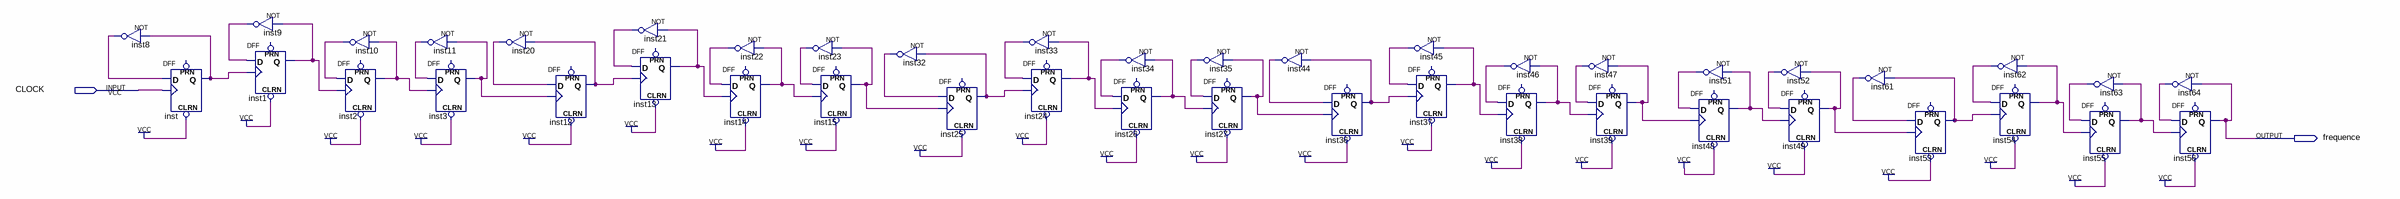
[diagram p0: schematic sheet]
// Quartus schematic basculeDbuzzer.bdf as structural Verilog: 44 symbols, 2 pins
module basculeDbuzzer (
  input  CLOCK,
  output frequence
);

  wire inst1_q, inst2_q, inst3_q, inst8_out, inst9_out, inst10_out, inst11_out, inst12_q, inst13_q, inst14_q,
       inst15_q, inst20_out, inst21_out, inst22_out, inst23_out, inst24_q, inst25_q, inst26_q, inst27_q,
       inst32_out, inst33_out, inst34_out, inst35_out, inst36_q, inst37_q, inst38_q, inst39_q, inst44_out,
       inst45_out, inst46_out, inst47_out, inst48_q, inst49_q, inst51_out, inst52_out, inst53_q, inst54_q,
       inst55_q, inst61_out, inst62_out, inst63_out, inst64_out, inst_q;

  not inst8 (inst8_out, inst_q);
  DFF inst (.CLRN(1'b1), .CLK(CLOCK), .D(inst8_out), .Q(inst_q));  // open: PRN
  not inst9 (inst9_out, inst1_q);
  DFF inst1 (.CLRN(1'b1), .CLK(inst_q), .D(inst9_out), .Q(inst1_q));  // open: PRN
  not inst10 (inst10_out, inst2_q);
  DFF inst2 (.CLRN(1'b1), .CLK(inst1_q), .D(inst10_out), .Q(inst2_q));  // open: PRN
  not inst11 (inst11_out, inst3_q);
  DFF inst3 (.CLRN(1'b1), .CLK(inst2_q), .D(inst11_out), .Q(inst3_q));  // open: PRN
  not inst20 (inst20_out, inst12_q);
  DFF inst12 (.CLRN(1'b1), .CLK(inst3_q), .D(inst20_out), .Q(inst12_q));  // open: PRN
  not inst21 (inst21_out, inst13_q);
  DFF inst13 (.CLRN(1'b1), .CLK(inst12_q), .D(inst21_out), .Q(inst13_q));  // open: PRN
  not inst22 (inst22_out, inst14_q);
  DFF inst14 (.CLRN(1'b1), .CLK(inst13_q), .D(inst22_out), .Q(inst14_q));  // open: PRN
  not inst23 (inst23_out, inst15_q);
  DFF inst15 (.CLRN(1'b1), .CLK(inst14_q), .D(inst23_out), .Q(inst15_q));  // open: PRN
  not inst32 (inst32_out, inst25_q);
  DFF inst25 (.CLRN(1'b1), .CLK(inst15_q), .D(inst32_out), .Q(inst25_q));  // open: PRN
  not inst33 (inst33_out, inst24_q);
  DFF inst24 (.CLRN(1'b1), .CLK(inst25_q), .D(inst33_out), .Q(inst24_q));  // open: PRN
  DFF inst26 (.CLRN(1'b1), .CLK(inst24_q), .D(inst34_out), .Q(inst26_q));  // open: PRN
  not inst34 (inst34_out, inst26_q);
  not inst35 (inst35_out, inst27_q);
  DFF inst27 (.CLRN(1'b1), .CLK(inst26_q), .D(inst35_out), .Q(inst27_q));  // open: PRN
  not inst44 (inst44_out, inst36_q);
  DFF inst36 (.CLRN(1'b1), .CLK(inst27_q), .D(inst44_out), .Q(inst36_q));  // open: PRN
  not inst45 (inst45_out, inst37_q);
  DFF inst37 (.CLRN(1'b1), .CLK(inst36_q), .D(inst45_out), .Q(inst37_q));  // open: PRN
  DFF inst38 (.CLRN(1'b1), .CLK(inst37_q), .D(inst46_out), .Q(inst38_q));  // open: PRN
  not inst46 (inst46_out, inst38_q);
  not inst47 (inst47_out, inst39_q);
  DFF inst39 (.CLRN(1'b1), .CLK(inst38_q), .D(inst47_out), .Q(inst39_q));  // open: PRN
  DFF inst48 (.CLRN(1'b1), .CLK(inst39_q), .D(inst51_out), .Q(inst48_q));  // open: PRN
  not inst51 (inst51_out, inst48_q);
  not inst52 (inst52_out, inst49_q);
  DFF inst49 (.CLRN(1'b1), .CLK(inst48_q), .D(inst52_out), .Q(inst49_q));  // open: PRN
  not inst61 (inst61_out, inst53_q);
  DFF inst53 (.CLRN(1'b1), .CLK(inst49_q), .D(inst61_out), .Q(inst53_q));  // open: PRN
  not inst62 (inst62_out, inst54_q);
  DFF inst54 (.CLRN(1'b1), .CLK(inst53_q), .D(inst62_out), .Q(inst54_q));  // open: PRN
  not inst63 (inst63_out, inst55_q);
  DFF inst55 (.CLRN(1'b1), .CLK(inst54_q), .D(inst63_out), .Q(inst55_q));  // open: PRN
  not inst64 (inst64_out, frequence);
  DFF inst56 (.CLRN(1'b1), .CLK(inst55_q), .D(inst64_out), .Q(frequence));  // open: PRN
endmodule
